# Altium project lsr_buttons.PrjPCB
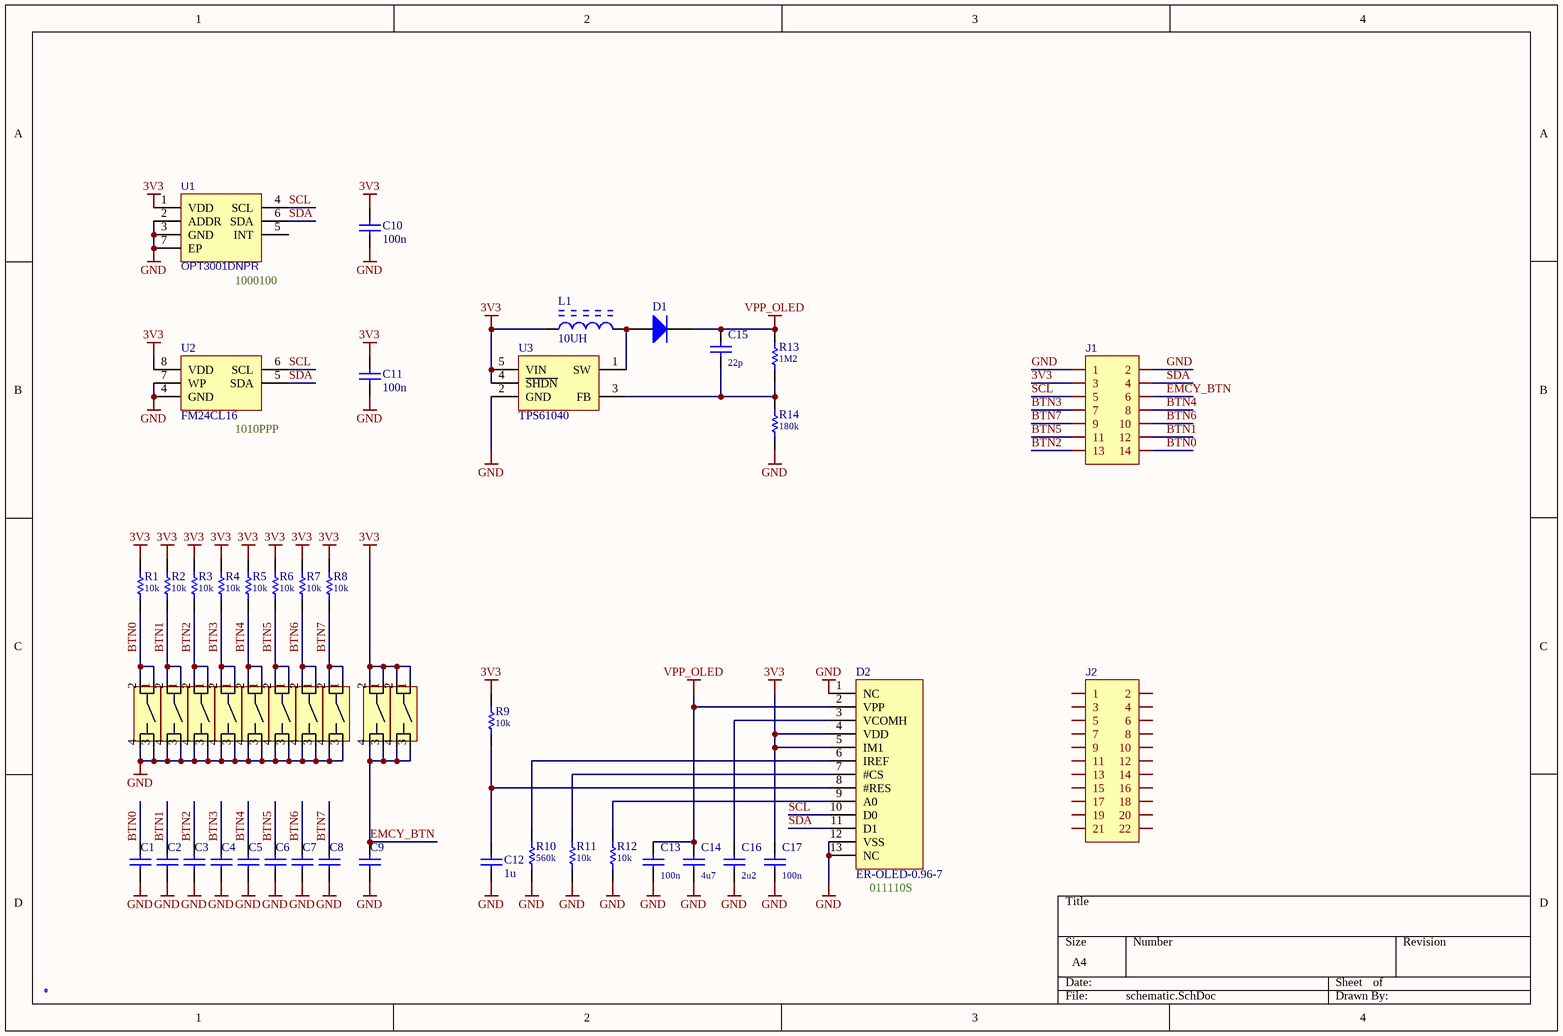
[diagram p0: schematic.SchDoc]
PRJ_ID: LSR Buttons; PRJ_VER: v1.0.0
1 sheet, 50 parts. Net scope: global (net labels, ports and power ports of the same name join across sheets).
Board file: board.PcbDoc

## Sheet schematic.SchDoc: Display & buttons board
size A4; Revision: 1; SheetNumber: 6; SheetTotal: 29

### Parts
C1  100n  [C0402]  (value not drawn)
C2  100n  [C0402]  (value not drawn)
C3  100n  [C0402]  (value not drawn)
C4  100n  [C0402]  (value not drawn)
C5  100n  [C0402]  (value not drawn)
C6  100n  [C0402]  (value not drawn)
C7  100n  [C0402]  (value not drawn)
C8  100n  [C0402]  (value not drawn)
C9  100n  [C0402]  (value not drawn)
C10  100n  [C0402]
C11  100n  [C0402]
C12  1u  [C0603]
C13  100n  [C0603]
C14  4u7  [C0805]
C15  22p  [C0603]
C16  2u2  [C0603]
C17  100n  [C0603]
D1  (no value)  [SOD-323]
D2  ER-OLED-0.96-7  [pico_oled_1.3]
J1  (no value)  [HDR-2X7-P2.00]
J2  (no value)  [HDR-2X11-P2.00]
L1  10UH  [IND_SDE0403A_4X4MM]
LOGO1  LOGO  [LOGO]  (value not drawn)  (no BOM)
R1  10k  [R0603]
R2  10k  [R0603]
R3  10k  [R0603]
R4  10k  [R0603]
R5  10k  [R0603]
R6  10k  [R0603]
R7  10k  [R0603]
R8  10k  [R0603]
R9  10k  [R0603]
R10  560k  [R0603]
R11  10k  [R0603]
R12  10k  [R0603]
R13  1M2  [R0603]
R14  180k  [R0603]
SW1  PTS810SJS250  [BTN_PTS810]  (value not drawn)
SW2  PTS810SJS250  [BTN_PTS810]  (value not drawn)
SW3  PTS810SJS250  [BTN_PTS810]  (value not drawn)
SW4  PTS810SJS250  [BTN_PTS810]  (value not drawn)
SW5  PTS810SJS250  [BTN_PTS810]  (value not drawn)
SW6  PTS810SJS250  [BTN_PTS810]  (value not drawn)
SW7  PTS810SJS250  [BTN_PTS810]  (value not drawn)
SW8  PTS810SJS250  [BTN_PTS810]  (value not drawn)
SW9  PTS810SJS250  [BTN_PTS810]  (value not drawn)
SW10  PTS810SJS250  [BTN_PTS810]  (value not drawn)
U1  OPT3001DNPR  [USON6_L2.1-W2.1-P0.65-BL-EP]
U2  FM24CL16  [SOIC-8]
U3  TPS61040  [SOT-23-5]

### Nets
3V3: C10.2 C11.2 C17.1 D2.4(VDD) D2.5(IM1) J1.3 L1.1 R1.2 R2.2 R3.2 R4.2 R5.2 R6.2 R7.2 R8.2 R9.2 SW9.1 SW9.2 SW10.1 SW10.2 U1.1(VDD) U2.8(VDD) U3.4(~{SHDN}) U3.5(VIN)
GND: C1.1 C2.1 C3.1 C4.1 C5.1 C6.1 C7.1 C8.1 C9.1 C10.1 C11.1 C12.1 C13.2 C14.2 C16.2 C17.2 D2.1(NC) D2.12(VSS) D2.13(NC) J1.1 J1.2 R10.1 R11.1 R12.1 R14.1 SW1.3 SW1.4 SW2.3 SW2.4 SW3.3 SW3.4 SW4.3 SW4.4 SW5.3 SW5.4 SW6.3 SW6.4 SW7.3 SW7.4 SW8.3 SW8.4 U1.2(ADDR) U1.3(GND) U1.7(EP) U2.4(GND) U2.7(WP) U3.2(GND)
VPP_OLED: C13.1 C14.1 C15.1 D1.2(K) D2.2(VPP) R13.2
BTN0: C1.2 J1.14 R1.1 SW1.1 SW1.2
BTN1: C2.2 J1.12 R2.1 SW2.1 SW2.2
BTN2: C3.2 J1.13 R3.1 SW3.1 SW3.2
BTN3: C4.2 J1.7 R4.1 SW4.1 SW4.2
BTN4: C5.2 J1.8 R5.1 SW5.1 SW5.2
BTN5: C6.2 J1.11 R6.1 SW6.1 SW6.2
BTN6: C7.2 J1.10 R7.1 SW7.1 SW7.2
BTN7: C8.2 J1.9 R8.1 SW8.1 SW8.2
EMCY_BTN: C9.2 J1.6 SW9.3 SW9.4 SW10.3 SW10.4
SCL: D2.10(D0) J1.5 U1.4(SCL) U2.6(SCL)
SDA: D2.11(D1) J1.4 U1.6(SDA) U2.5(SDA)
NetC12_2: C12.2 D2.8(#RES) R9.1
NetC15_2: C15.2 R13.1 R14.2 U3.3(FB)
NetC16_1: C16.1 D2.3(VCOMH)
NetD1_1: D1.1(A) L1.2 U3.1(SW)
NetD2_6: D2.6(IREF) R10.2
NetD2_7: D2.7(#CS) R11.2
NetD2_9: D2.9(A0) R12.2

Not connected (* = marked no-connect by the designer): J2 1 2 3 4 5 6 7 8 9 10 11 12 13 14 15 16 17 18 19 20 21 22; U1 5(INT)

### Notes on the sheet
- (near U1) 1000100
- (near U2) 1010PPP
- (near D2) 011110S
- (in symbol RES) t°

### Library data of the parts
C1-C12 = Cap
C13-C17 = CAP
D1 = US1M-13-F
D2 = Component_1
J1 = HDR 2X7
J2 = HDR 2X11
L1 = SRN3015-100M: 10uH 1A 2520
R1-R8 R10 R13 R14 = RES
R9 R11 R12 = RES_0402_1K5-1%: 10k 0603
SW1-SW10 = Component_1: P/N: PTS810SJK250SMTRLFS; LCSC part number: C221896
U2 = MB85RC16
U3 = LM27313XMFX
U1 = OPT3001DNPR: LCSC part number: C90462; P/N: OPT3001DNPR